# Altium project CorgPass.PrjPcb
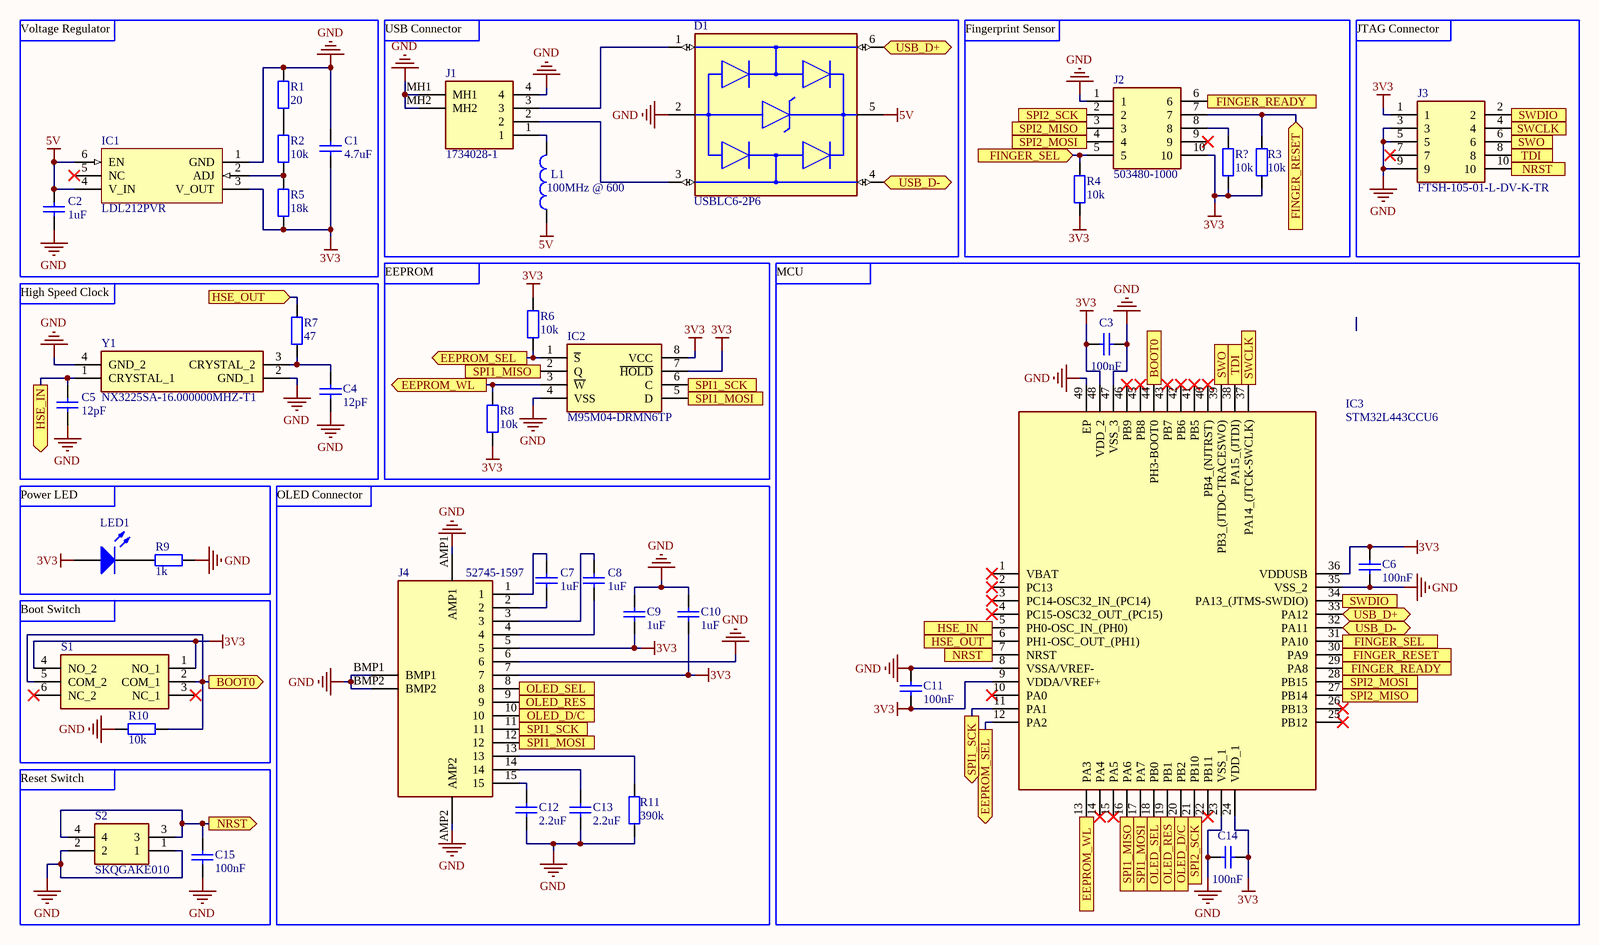
[diagram p0: CorgPassRev1.SchDoc]
1 sheet, 40 parts. Net scope: flat (ports and power ports of the same name join across sheets).
Board files: CorgPassRev1.PcbDoc, CorgPassRev2.PcbDoc

## Sheet CorgPassRev1.SchDoc: CorgPass
size A3; Author: martinkors; DrawnBy: martinkors; DocumentNumber: 1/1; Revision: 01; SheetNumber: 1; SheetTotal: 1

### Parts
C1  4.7uF  [CL10A475KQ8NNNC]
C2  value 1uF  [CL05A105KQ5NNNC]  (hidden comment: Cap)
C3  value 100nF  [CL05B104KQ5NNNC]  (hidden comment: Cap)
C4  value 12pF  [CL10C120JB81PNC]  (hidden comment: Cap)
C5  value 12pF  [CL10C120JB81PNC]  (hidden comment: Cap)
C6  value 100nF  [CL05B104KQ5NNNC]  (hidden comment: Cap)
C7  value 1uF  [CL05A105KQ5NNNC]  (hidden comment: Cap)
C8  value 1uF  [CL05A105KQ5NNNC]  (hidden comment: Cap)
C9  value 1uF  [CL05A105KQ5NNNC]  (hidden comment: Cap)
C10  value 1uF  [CL05A105KQ5NNNC]  (hidden comment: Cap)
C11  value 100nF  [CL05B104KQ5NNNC]  (hidden comment: Cap)
C12  value 2.2uF  [CL10A225KA8NNNC]  (hidden comment: Cap)
C13  value 2.2uF  [CL10A225KA8NNNC]  (hidden comment: Cap)
C14  value 100nF  [CL05B104KQ5NNNC]  (hidden comment: Cap)
C15  value 100nF  [CL05B104KQ5NNNC]  (hidden comment: Cap)
D1  USBLC6-2P6  [FP-SOT-666-MFG]
IC1  LDL212PVR  [LDL212PVR]
IC2  M95M04-DRMN6TP  [SOIC127P600X175-8N]
IC3  STM32L443CCU6  [QFN50P700X700X60-49N-D]
J1  1734028-1  [117340281]
J2  503480-1000  [5034801000]
J3  FTSH-105-01-L-DV-K-TR  [FTSH10501LDVKTR]
J4  52745-1597  [527451597]
L1  100MHz @ 600  [742792040]
LED1  150080RS75000  [0805_A]  (value not drawn)
R1  value 20  [ERJ-UP3F20R0V]  (hidden comment: Res2)
R2  value 10k  [ERJ-UP3F1002V]  (hidden comment: Res2)
R3  value 10k  [ERJ-UP3F1002V]  (hidden comment: Res2)
R4  value 10k  [ERJ-UP3F1002V]  (hidden comment: Res2)
R5  value 18k  [ERJ-UP3F1802V]  (hidden comment: Res2)
R6  value 10k  [ERJ-UP3F1002V]  (hidden comment: Res2)
R7  value 47  [ERJ-UP3J470V]  (hidden comment: Res2)
R8  value 10k  [ERJ-UP3F1002V]  (hidden comment: Res2)
R9  value 1k  [ERJ-UP3F1001V]  (hidden comment: Res2)
R10  value 10k  [ERJ-UP3F1002V]  (hidden comment: Res2)
R11  value 390k  [ERJ-UP3F3903V]  (hidden comment: Res2)
R?  value 10k  [ERJ-UP3F1002V]  (hidden comment: Res2)
S1  452403012014  [452403012014]  (value not drawn)
S2  SKQGAKE010  [SKQGAKE010]
Y1  NX3225SA-16.000000MHZ-T1  [NX3225SA16000000MHZT1]

### Ports
BOOT0 (in), BOOT0 (out), EEPROM_SEL (out), EEPROM_WL (out), FINGER_READY (in), FINGER_READY (out), FINGER_RESET (in), FINGER_RESET (out), FINGER_SEL (in), FINGER_SEL (out), HSE_IN (in), HSE_IN (out), HSE_OUT (in), HSE_OUT (out), NRST (in), NRST (out), OLED_D/C (in), OLED_D/C (out), OLED_RES (in), OLED_RES (out), OLED_SEL (in), OLED_SEL (out), SPI1_MISO (in), SPI1_MISO (out), SPI1_MOSI (in), SPI1_MOSI (out), SPI1_SCK (in), SPI1_SCK (out), SPI2_MISO (in), SPI2_MISO (out), SPI2_MOSI (in), SPI2_MOSI (out), SPI2_SCK (in), SPI2_SCK (out), SWCLK (in), SWDIO (in), SWO (in), TDI (in), USB_D+ (bidir), USB_D- (bidir)

### Nets
3V3: C1.1 C3.2 C6.1 C9.2 C10.2 C11.2 C14.1 IC1.3(V_OUT) IC2.7(~{HOLD}) IC2.8(VCC) IC3.9(VDDA/VREF+) IC3.24(VDD_1) IC3.36(VDDUSB) IC3.48(VDD_2) J2.10 J3.1 J4.5 J4.7 LED1.2(A) R3.1 R4.1 R5.1 R6.2 R8.1 R?.1 S1.1(NO_1) S1.4(NO_2)
5V: C2.2 D1.5(VBUS) IC1.4(V_IN) IC1.6(EN) L1.1
GND: C1.2 C2.1 C3.1 C4.1 C5.1 C6.2 C9.1 C10.1 C11.1 C12.1 C13.2 C14.2 C15.2 D1.2(GND) IC1.1(GND) IC2.4(VSS) IC3.8(VSSA/VREF-) IC3.23(VSS_1) IC3.35(VSS_2) IC3.47(VSS_3) IC3.49(EP) J1.4 J1.MH1 J1.MH2 J2.1 J3.3 J3.5 J3.9 J4.6 J4.AMP1 J4.AMP2 J4.BMP1 J4.BMP2 R1.2 R9.1 R10.2 R11.1 S2.1 S2.2 Y1.2(GND_1) Y1.4(GND_2)
NetC4_2: C4.2 R7.1 Y1.3(CRYSTAL_2)
NetC5_2: C5.2 IC3.5(PH0-OSC_IN_(PH0)) Y1.1(CRYSTAL_1) ; port HSE_IN
NetC7_1: C7.1 J4.2
NetC7_2: C7.2 J4.1
NetC8_1: C8.1 J4.3
NetC8_2: C8.2 J4.4
NetC12_2: C12.2 J4.15
NetC13_1: C13.1 J4.14
NetC15_1: C15.1 IC3.7(NRST) J3.10 S2.3 S2.4 ; port NRST
NetD1_1: D1.1(I/O1) J1.3
NetD1_3: D1.3(I/O2) J1.2
NetD1_4: D1.4(I/O2) IC3.32(PA11) ; port USB_D-
NetD1_6: D1.6(I/O1) IC3.33(PA12) ; port USB_D+
NetIC1_2: IC1.2(ADJ) R2.1 R5.2
NetIC2_1: IC2.1(~{S}) IC3.12(PA2) R6.1 ; port EEPROM_SEL
NetIC2_2: IC2.2(Q) IC3.16(PA6) ; port SPI1_MISO
NetIC2_3: IC2.3(~{W}) IC3.13(PA3) R8.2 ; port EEPROM_WL
NetIC2_5: IC2.5(D) IC3.17(PA7) J4.12 ; port SPI1_MOSI
NetIC2_6: IC2.6(C) IC3.11(PA1) J4.11 ; port SPI1_SCK
NetIC3_6: IC3.6(PH1-OSC_OUT_(PH1)) R7.2 ; port HSE_OUT
NetIC3_18: IC3.18(PB0) J4.8 ; port OLED_SEL
NetIC3_19: IC3.19(PB1) J4.9 ; port OLED_RES
NetIC3_20: IC3.20(PB2) J4.10 ; port OLED_D/C
NetIC3_21: IC3.21(PB10) J2.2 ; port SPI2_SCK
NetIC3_27: IC3.27(PB14) J2.3 ; port SPI2_MISO
NetIC3_28: IC3.28(PB15) J2.4 ; port SPI2_MOSI
NetIC3_29: IC3.29(PA8) J2.6 ; port FINGER_READY
NetIC3_30: IC3.30(PA9) J2.7 R3.2 ; port FINGER_RESET
NetIC3_31: IC3.31(PA10) J2.5 R4.2 ; port FINGER_SEL
NetIC3_34: IC3.34(PA13_(JTMS-SWDIO)) J3.2 ; port SWDIO
NetIC3_37: IC3.37(PA14_(JTCK-SWCLK)) J3.4 ; port SWCLK
NetIC3_38: IC3.38(PA15_(JTDI)) J3.8 ; port TDI
NetIC3_39: IC3.39(PB3_(JTDO-TRACESWO)) J3.6 ; port SWO
NetIC3_44: IC3.44(PH3-BOOT0) R10.1 S1.2(COM_1) S1.5(COM_2) ; port BOOT0
NetJ1_1: J1.1 L1.2
NetJ2_8: J2.8 R?.2
NetJ4_13: J4.13 R11.2
NetLED1_1: LED1.1(K) R9.2
NetR1_1: R1.1 R2.2

Not connected (* = marked no-connect by the designer): IC1 5(NC)*; IC3 1(VBAT)* 2(PC13)* 3(PC14-OSC32_IN_(PC14))* 4(PC15-OSC32_OUT_(PC15))* 10(PA0)* 14(PA4)* 15(PA5)* 22(PB11)* 25(PB12)* 26(PB13)* 40(PB4_(NJTRST))* 41(PB5)* 42(PB6)* 43(PB7)* 45(PB8)* 46(PB9)*; J2 9*; J3 7*; S1 3(NC_1)* 6(NC_2)*

### Notes on the sheet
- Voltage Regulator
- USB Connector
- Fingerprint Sensor
- JTAG Connector
- High Speed Clock
- EEPROM
- MCU
- Power LED
- OLED Connector
- Boot Switch
- Reset Switch

### Library data of the parts
C1 = Cap: Cap Ceramic 4.7uF 6.3V X5R 10% SMD 0603 85°C Paper T/R; Manufacturer: Samsung; Tolerance: 20%; Published: 8-Jun-2000; LatestRevisionDate: 17-Jul-2002; LatestRevisionNote: Re-released for DXP Platform.; PackageReference: RAD-0.3; Publisher: Altium Limited; PackageDescription: Radial Cap, Thru-Hole; 2 Leads; 0.3 in Pin Spacing; Value: 4.7uF; Supplier 1: Mouser; Supplier Part Number 1: 187-CL10A475KQ8NNNC; Manufacturer Part Number: CL10A475KQ8NNNC; RoHS: Yes; Category: Ceramic Capacitors; Stock 1: 199260; Pricing 1: 1=0.13000, 10=0.04700, 50=0.04700, 100=0.02100, 500=0.01500, 1000=0.01200, 4000=0.01000, 8000=0.00800, 10000=0.00800 (USD); Mount: Surface Mount; Case/Package: 0603; Case Code (Metric): 1608; Case Code (Imperial): 0603; Material: Ceramic; Contact Plating: Tin; Min Operating Temperature: -55°C; Max Operating Temperature: 85°C; Capacitance: 4.7uF; Dielectric: X5R; Packaging: Tape and Reel; Package Quantity: 1; Voltage Rating: 6.3V; Voltage: 6.3V; Series: CL; Construction: Flat; Length: 1.6mm; Width: 0.031inch; Height: 0.8mm; Thickness: 0.035inch; Depth: 0.8mm; Radiation Hardening: No; RoHS Compliant: Yes; ComponentLink1URL: https://datasheet.ciiva.com/15195/getdatasheetpartid-358620-15195714.pdf?src-supplier=Verical; ComponentLink1Description: https://datasheet.ciiva.com/15195/getdatasheetpartid-358620-15195714.pdf?src-supplier=Verical; ComponentLink2URL: https://datasheet.ciiva.com/29198/457675-da-01-en-vs-kondensator-0603-29198672.pdf?src-supplier=Conrad; ComponentLink2Description: https://datasheet.ciiva.com/29198/457675-da-01-en-vs-kondensator-0603-29198672.pdf?src-supplier=Conrad; ComponentLink3URL: https://datasheet.ciiva.com/16437/cl05b104kq5nnnc-16437321.pdf?src-supplier=Future+Electronics; ComponentLink3Description: https://datasheet.ciiva.com/16437/cl05b104kq5nnnc-16437321.pdf?src-supplier=Future+Electronics
C2 C7-C10 = Cap: Ceramic capacitor SMD-0402 1000nF /6.3V X5R# K +-10%, Samsung, RoHS; Tolerance: 10%; Dielectric: X5R; Voltage Rating: 6.3V; Published: 8-Jun-2000; LatestRevisionDate: 17-Jul-2002; LatestRevisionNote: Re-released for DXP Platform.; PackageReference: RAD-0.3; Publisher: Altium Limited; PackageDescription: Radial Cap, Thru-Hole; 2 Leads; 0.3 in Pin Spacing; Supplier 1: Mouser; Supplier Part Number 1: 187-CL05A105KQ5NNNC; Manufacturer: Samsung; Manufacturer Part Number: CL05A105KQ5NNNC; RoHS: Yes; Category: Ceramic Capacitors; Stock 1: 1554203; Pricing 1: 1=0.10000, 10=0.01100, 50=0.01100, 100=0.00900, 500=0.00700, 1000=0.00500, 5000=0.00400, 10000=0.00300 (USD); Mount: Surface Mount; Case/Package: 0402; Case Code (Metric): 1005; Case Code (Imperial): 0402; Material: Ceramic; Min Operating Temperature: -55°C; Max Operating Temperature: 85°C; Capacitance: 1uF; Packaging: Tape and Reel; Voltage: 6.3V; Voltage Rating (DC): 6.3V; Series: CL; Construction: Flat; Length: 1mm; Width: 0.02inch; Height: 0.5mm; Thickness: 0.022inch; Depth: 0.5mm; Radiation Hardening: No; Lead Free: Lead Free; RoHS Compliant: Yes; ComponentLink1URL: https://datasheet.ciiva.com/25709/cl05a105kq5nnnc-25709776.pdf?src-supplier=Digi-Key; ComponentLink1Description: https://datasheet.ciiva.com/25709/cl05a105kq5nnnc-25709776.pdf?src-supplier=Digi-Key; ComponentLink2URL: https://datasheet.ciiva.com/15195/getdatasheetpartid-358391-15195631.pdf?src-supplier=Verical; ComponentLink2Description: https://datasheet.ciiva.com/15195/getdatasheetpartid-358391-15195631.pdf?src-supplier=Verical; ComponentLink3URL: https://datasheet.ciiva.com/29198/459172-da-01-en-vs-kondensator-0402-29198343.pdf?src-supplier=Conrad; ComponentLink3Description: https://datasheet.ciiva.com/29198/459172-da-01-en-vs-kondensator-0402-29198343.pdf?src-supplier=Conrad; ComponentLink4URL: https://datasheet.ciiva.com/16339/cl05b104kq5nnnc-16339614.pdf?src-supplier=Future+Electronics; ComponentLink4Description: https://datasheet.ciiva.com/16339/cl05b104kq5nnnc-16339614.pdf?src-supplier=Future+Electronics
C3 C6 C11 C14 C15 = Cap: Cap Ceramic 0.1uF 6.3V X7R 10% SMD 0402 125°C Paper T/R; Manufacturer: Samsung; Published: 8-Jun-2000; LatestRevisionDate: 17-Jul-2002; LatestRevisionNote: Re-released for DXP Platform.; PackageReference: RAD-0.3; Publisher: Altium Limited; PackageDescription: Radial Cap, Thru-Hole; 2 Leads; 0.3 in Pin Spacing; Supplier 1: Mouser; Supplier Part Number 1: 187-CL05B104KQ5NNNC; Manufacturer Part Number: CL05B104KQ5NNNC; RoHS: Yes; Category: Ceramic Capacitors; Stock 1: 56542; Pricing 1: 1=0.10000, 10=0.01400, 50=0.01400, 100=0.01200, 1000=0.00700, 10000=0.00400 (USD); Mount: Surface Mount; Case/Package: 0402; Case Code (Metric): 1005; Case Code (Imperial): 0402; Min Operating Temperature: -55°C; Max Operating Temperature: 125°C; Tolerance: 10%; Capacitance: 100nF; Dielectric: X7R; Packaging: Tape and Reel; Voltage Rating: 6.3V; Voltage Rating (DC): 6.3V; Length: 1mm; Width: 0.02inch; Height: 0.5mm; Thickness: 0.022inch; Depth: 0.5mm; Radiation Hardening: No; Lead Free: Lead Free; ComponentLink1URL: https://datasheet.ciiva.com/25709/cl05b104kq5nnnc-25709268.pdf?src-supplier=Digi-Key; ComponentLink1Description: https://datasheet.ciiva.com/25709/cl05b104kq5nnnc-25709268.pdf?src-supplier=Digi-Key; ComponentLink2URL: https://datasheet.ciiva.com/26838/getdatasheetpartid-494330-26838215.pdf?src-supplier=Verical; ComponentLink2Description: https://datasheet.ciiva.com/26838/getdatasheetpartid-494330-26838215.pdf?src-supplier=Verical; ComponentLink3URL: https://datasheet.ciiva.com/16498/cl05b104kq5nnnc-16498492.pdf?src-supplier=Future+Electronics; ComponentLink3Description: https://datasheet.ciiva.com/16498/cl05b104kq5nnnc-16498492.pdf?src-supplier=Future+Electronics
C4 C5 = Cap: Cap Ceramic 12pF 50V C0G 5% SMD 0603 125C Automotive Cardboard T/R; Manufacturer: Samsung; Temperature Coefficient: 300ppm/°C; Published: 8-Jun-2000; LatestRevisionDate: 17-Jul-2002; LatestRevisionNote: Re-released for DXP Platform.; PackageReference: RAD-0.3; Publisher: Altium Limited; PackageDescription: Radial Cap, Thru-Hole; 2 Leads; 0.3 in Pin Spacing; Supplier 1: Mouser; Supplier Part Number 1: 187-CL10C120JB81PNC; Manufacturer Part Number: CL10C120JB81PNC; RoHS: Yes; Category: Ceramic Capacitors; Stock 1: 33780; Pricing 1: 1=0.11000, 10=0.05000, 50=0.05000, 100=0.02300, 1000=0.01300, 10000=0.00800 (USD); Mount: Surface Mount; Case/Package: 0603; Case Code (Metric): 1608; Case Code (Imperial): 0603; Min Operating Temperature: -55°C; Max Operating Temperature: 125°C; Packaging: Tape and Reel; Tolerance: 5%; Package Quantity: 4000; Capacitance: 12pF; Voltage Rating: 50V; Voltage: 50V; Dielectric: C0G; Length: 1.6mm; Width: 0.031inch; Height: 0.8mm; Thickness: 0.035inch; Depth: 0.8mm; Ratings: AEC-Q200; Radiation Hardening: No; Lead Free: Lead Free; ComponentLink1URL: https://datasheet.ciiva.com/15195/getdatasheetpartid-494032-15195793.pdf?src-supplier=Verical; ComponentLink1Description: https://datasheet.ciiva.com/15195/getdatasheetpartid-494032-15195793.pdf?src-supplier=Verical; ComponentLink2URL: https://datasheet.ciiva.com/16437/cl10c120jb81pnc-16437304.pdf?src-supplier=Future+Electronics; ComponentLink2Description: https://datasheet.ciiva.com/16437/cl10c120jb81pnc-16437304.pdf?src-supplier=Future+Electronics
C12 C13 = Cap: Ceramic capacitor SMD-0603 2200nF/25V X5R# K +-10%, SAMSUNG, RoHS; Tolerance: 10%; Dielectric: X5R; Voltage Rating: 25V; Published: 8-Jun-2000; LatestRevisionDate: 17-Jul-2002; LatestRevisionNote: Re-released for DXP Platform.; PackageReference: RAD-0.3; Publisher: Altium Limited; PackageDescription: Radial Cap, Thru-Hole; 2 Leads; 0.3 in Pin Spacing; Supplier 1: Mouser; Supplier Part Number 1: 187-CL10A225KA8NNNC; Manufacturer: Samsung; Manufacturer Part Number: CL10A225KA8NNNC; RoHS: Yes; Category: Ceramic Capacitors; Stock 1: 114346; Pricing 1: 1=0.22000, 10=0.09000, 50=0.09000, 100=0.07700, 500=0.05300, 1000=0.04700, 4000=0.04000, 8000=0.03800, 10000=0.03800 (USD); Mount: Surface Mount; Case/Package: 0603; Case Code (Metric): 1608; Case Code (Imperial): 0603; Min Operating Temperature: -55°C; Max Operating Temperature: 85°C; Capacitance: 2.2uF; Packaging: Tape and Reel; Package Quantity: 1; Voltage Rating (DC): 25V; Series: CL; Construction: Flat; Length: 1.6mm; Width: 0.031inch; Height: 0.8mm; Thickness: 0.035inch; Depth: 0.8mm; Radiation Hardening: No; Lead Free: Lead Free; RoHS Compliant: Yes; ComponentLink1URL: https://datasheet.ciiva.com/25797/cl10a225ka8nnnc-25797781.pdf?src-supplier=Digi-Key; ComponentLink1Description: https://datasheet.ciiva.com/25797/cl10a225ka8nnnc-25797781.pdf?src-supplier=Digi-Key
D1 = CMP-12225-000058-1: TVS DIODE 5.25V 17V SOT666; Manufacturer: STMicroelectronics; Min Breakdown Voltage: 6V; Power Line Protection: Yes; Element Configuration: Dual; Test Current: 1mA; Working Voltage: 5V; Number of Channels: 2; Max Reverse Leakage Current: 150nA; Direction: Unidirectional; Peak Pulse Current: 5A; Number of Elements: 1; Capacitance: 3.5pF; Max Breakdown Voltage: 6V; Height: 0.6mm; Depth: 1.3mm; Contact Plating: Tin; Reverse Breakdown Voltage: 6V; REACH SVHC: No SVHC; Operating Supply Voltage: 5V; Width: 1.3mm; Max Operating Temperature: 125°C; Reverse Standoff Voltage: 5V; ESD Protection: Yes; Package Quantity: 1; Termination: SMD/SMT; Length: 1.7mm; Leakage Current: 150nA; Number of Bidirectional Channels: 2; Case/Package: SOT-666; Min Operating Temperature: -40°C; Number of Pins: 6; Clamping Voltage: 17V; Breakdown Voltage: 6V; Lead Free: Lead Free; Radiation Hardening: No; Packaging: Tape and Reel; Mount: Surface Mount; Polarity: Unidirectional; Supplier 1: Mouser; Supplier Part Number 1: 511-USBLC6-2P6; Manufacturer Part Number: USBLC6-2P6; RoHS: Yes; Category: TVS Diodes; Pricing 1: 1=0.65000, 10=0.55700, 50=0.55700, 100=0.41600, 500=0.32700, 1000=0.25300, 3000=0.23000, 10000=0.23000 (USD); Series: USB; Clamping Voltage-Max: 17V; RoHS Compliant: Yes; ComponentLink1URL: https://datasheet.ciiva.com/14186/usblc6-2-st-eng-tds-14186568.pdf?src-supplier=Distrelec; ComponentLink1Description: https://datasheet.ciiva.com/14186/usblc6-2-st-eng-tds-14186568.pdf?src-supplier=Distrelec; ComponentLink2URL: https://datasheet.ciiva.com/22685/1690354-22685832.pdf?src-supplier=Element14; ComponentLink2Description: https://datasheet.ciiva.com/22685/1690354-22685832.pdf?src-supplier=Element14; ComponentLink3URL: https://datasheet.ciiva.com/22692/1690354-22692453.pdf?src-supplier=Element14; ComponentLink3Description: https://datasheet.ciiva.com/22692/1690354-22692453.pdf?src-supplier=Element14; ComponentLink4URL: https://datasheet.ciiva.com/4508/cd00050750-4508892.pdf?src-supplier=Mouser; ComponentLink4Description: https://datasheet.ciiva.com/4508/cd00050750-4508892.pdf?src-supplier=Mouser; ComponentLink5URL: https://datasheet.ciiva.com/16378/cd00050750-16378714.pdf?src-supplier=Future+Electronics; ComponentLink5Description: https://datasheet.ciiva.com/16378/cd00050750-16378714.pdf?src-supplier=Future+Electronics; ComponentLink6URL: https://datasheet.ciiva.com/41444/001184108-da-01-en-ic-esd-protection-usblc6-2p6-sot-666-stm-41444134.pdf?src-supplier=Conrad; ComponentLink6Description: https://datasheet.ciiva.com/41444/001184108-da-01-en-ic-esd-protection-usblc6-2p6-sot-666-stm-41444134.pdf?src-supplier=Conrad
IC1 = LDL212PVR: LDL212 Series 18 V 1.2 A Adj. High PSRR Low Drop Linear Regulator IC - DFN-6; Manufacturer: STMicroelectronics; Output Voltage: 17.65V; Output Current: 1.2A; Dropout Voltage: 350mV; Number of Regulators: 1; Supplier 1: Mouser; Supplier Part Number 1: 511-LDL212PVR; Manufacturer Part Number: LDL212PVR; RoHS: Yes; Category: Voltage Regulators - Linear; Pricing 1: 1=0.63000, 10=0.50200, 50=0.50200, 100=0.37300, 500=0.31500, 1000=0.24400, 3000=0.22100, 6000=0.21600, 10000=0.21600 (USD); Min Operating Temperature: -40°C; Max Operating Temperature: 125°C; RoHS Compliant: Yes; ComponentLink1URL: http://www.mouser.com/ds/2/389/ldl212-974162.pdf?src-supplier=Mouser; ComponentLink1Description: http://www.mouser.com/ds/2/389/ldl212-974162.pdf?src-supplier=Mouser; ComponentLink2URL: http://www.st.com/content/ccc/resource/sales_and_marketing/promotional_material/brochure/group0/cb/7a/af/56/f7/bd/47/e9/Brochure%20Power%20management%20guide/files/Brochure_Power_Management.pdf/jcr:content/translations/en.Brochure_Power_Management.pdf?src-supplier=Digi-Key; ComponentLink2Description: http://www.st.com/content/ccc/resource/sales_and_marketing/promotional_material/brochure/group0/cb/7a/af/56/f7/bd/47/e9/Brochure%20Power%20management%20guide/files/Brochure_Power_Management.pdf/jcr:content/translations/en.Brochure_Power_Management.pdf?src-supplier=Digi-Key
IC2 = M95M04-DRMN6TP: EEPROM Spi 4MBIT 512K X 8 1.8V to 5.5V 8-PIN SOIC T/r; Manufacturer_Name: STMicroelectronics; Datasheet Link: https://componentsearchengine.com/Datasheets/1/M95M04-DRMN6TP.pdf; Height: 1.75mm; Manufacturer_Part_Number: M95M04-DRMN6TP; Supplier 1: Mouser; Supplier Part Number 1: 511-M95M04-DRMN6TP; Manufacturer: STMicroelectronics; Manufacturer Part Number: M95M04-DRMN6TP; RoHS: Yes; Category: Memory; Stock 1: 1275; Pricing 1: 1=3.16000, 10=2.80000, 50=2.80000, 100=2.50000, 1000=2.29000, 10000=2.28000 (USD)
IC3 = STM32L443CCU6: Ultra-low-power with FPU ARM Cortex-M4 MCU 80 MHz with 256 Kbytes Flash, LCD, USB, AES-256; Manufacturer_Name: STMicroelectronics; Interface: I2C,SPI,USB,IrDA,MMC,SD,UART,USART; Peripherals: Brown-out Detect/Reset,PWM,WDT,DMA,LCD; Frequency: 80MHz; Number of I/Os: 38; Memory Size: 256KB; Oscillator Type: Internal; Datasheet Link: https://componentsearchengine.com//STM32L443CCU6.pdf; Height: 0.6mm; Mouser2 Part Number: 511-STM32L443CCU6; Mouser2 Price/Stock: https://www.mouser.com/Search/Refine.aspx?Keyword=511-STM32L443CCU6; Manufacturer_Part_Number: STM32L443CCU6; Supplier 1: Mouser; Supplier Part Number 1: 511-STM32L443CCU6; Manufacturer: STMicroelectronics; Manufacturer Part Number: STM32L443CCU6; RoHS: Yes; Category: Microcontrollers; Stock 1: 40; Pricing 1: 1=7.24000, 10=6.55000, 25=6.25000, 50=6.25000, 100=5.43000, 250=5.18000, 500=4.73000, 1000=4.07000, 2500=4.06000, 10000=4.07000 (USD); Case/Package: UFQFPN; Number of Pins: 48; Min Operating Temperature: -40°C; Max Operating Temperature: 85°C; Memory Type: FLASH; Packaging: Tray; Core Architecture: ARM; ComponentLink1URL: http://www.st.com/content/ccc/resource/technical/document/datasheet/01/76/9c/b5/c7/d9/40/6c/DM00254865.pdf/files/DM00254865.pdf/jcr:content/translations/en.DM00254865.pdf?src-supplier=Digi-Key; ComponentLink1Description: http://www.st.com/content/ccc/resource/technical/document/datasheet/01/76/9c/b5/c7/d9/40/6c/DM00254865.pdf/files/DM00254865.pdf/jcr:content/translations/en.DM00254865.pdf?src-supplier=Digi-Key
J1 = 1-1734028-1: Conn USB 2.0 Type A PL 4 POS Solder RA Edge Mount 4 Terminal 1 Port Tray; Manufacturer: TE Connectivity; Plating: Copper; Number of Terminals/Pins: 4; Gender: Female; Connector Type: Plug; Number of Ports: 1; Circuit Application: Signal; Connector System: Cable-to-Board; Contact Current Rating: 1.5A; Max Voltage Rating (AC): 30V; Plating Thickness: 0.76um; Pitch: 2.5mm; PCB Thickness: 1.6mm; Supplier 1: Mouser; Supplier Part Number 1: 571-1734028-1; Manufacturer Part Number: 1734028-1; RoHS: Yes; Category: Audio / Video Connectors; Stock 1: 6449; Pricing 1: 1=1.51000, 10=1.19000, 50=1.19000, 100=0.99100, 500=0.85000, 1000=0.79500, 2500=0.74400, 5000=0.72100, 9600=0.70000, 10000=0.70000, 25600=0.64500 (USD); Mount: Surface Mount,Horizontal,Edge; Contact Material: Brass; Contact Plating: Gold; Housing Material: Thermoplastic; Housing Color: Natural; Color: Natural; Min Operating Temperature: -67°C; Max Operating Temperature: 185°C; Number of Contacts: 4; Termination: SMD/SMT; Packaging: Tape and Reel; Package Quantity: 3200; Orientation: Right Angle; Number of Positions: 4; Length: 12mm; Depth: 19.65mm; Radiation Hardening: No; Flammability Rating: UL94 V-0; ELV: Compliant; Lead Free: Lead Free; ComponentLink1URL: https://datasheet.ciiva.com/3094/eng-ds-1-1773453-6-0908-3094652.pdf?src-supplier=Avnet; ComponentLink1Description: https://datasheet.ciiva.com/3094/eng-ds-1-1773453-6-0908-3094652.pdf?src-supplier=Avnet; ComponentLink2URL: https://datasheet.ciiva.com/851/eng-cd-1734028-c-851585.pdf?src-supplier=Digi-Key; ComponentLink2Description: https://datasheet.ciiva.com/851/eng-cd-1734028-c-851585.pdf?src-supplier=Digi-Key; ComponentLink3URL: https://datasheet.ciiva.com/16313/tyco201734028-1-16313266.pdf?src-supplier=Future+Electronics; ComponentLink3Description: https://datasheet.ciiva.com/16313/tyco201734028-1-16313266.pdf?src-supplier=Future+Electronics; ComponentLink4URL: https://datasheet.ciiva.com/16668/eng-ds-1-1773453-6-0908-16668521.pdf?src-supplier=Avnet+Europe; ComponentLink4Description: https://datasheet.ciiva.com/16668/eng-ds-1-1773453-6-0908-16668521.pdf?src-supplier=Avnet+Europe; Name: 1734028-1
J2 = 503480-1000: FPC/FFC 间距0.5mm 10pin 前插后压 H=1.0mm; Manufacturer_Name: Molex; Actuator Material: Nylon,Glass,Polyamide; Current Rating: 500mA; Voltage Rating: 50V; Number of Positions: 10; Gender: Receptacle; Wire/Cable Type: Straight; Stackable: No; Pitch: 0.5mm; Datasheet Link: https://componentsearchengine.com//503480-1000.pdf; Mouser2 Part Number: 538-503480-1000; Mouser2 Price/Stock: https://www.mouser.com/Search/Refine.aspx?Keyword=538-503480-1000; Manufacturer_Part_Number: 503480-1000; Supplier 1: Mouser; Supplier Part Number 1: 538-503480-1000; Manufacturer: Molex; Manufacturer Part Number: 503480-1000; RoHS: Yes; Category: FFC / FPC; Stock 1: 13096; Pricing 1: 1=1.41000, 10=1.20000, 50=1.20000, 100=0.99000, 500=0.91200, 1000=0.78200, 3000=0.72900, 6000=0.69200, 9000=0.67600, 10000=0.67600, 24000=0.65100 (USD); Contact Material: Bronze; Contact Plating: Gold; Housing Material: Polymer; Housing Color: White; Material: Bronze; Min Operating Temperature: -40°C; Max Operating Temperature: 85°C; Package Quantity: 1; Number of Rows: 1; Packaging: Tape and Reel; Termination: Solder; Number of Contacts: 10; Orientation: Right Angle; Voltage Rating (AC): 50V; Max Voltage Rating (AC): 50V; Max Voltage Rating (DC): 50V; Number of Circuits: 10; Mating Cycles: 10; Length: 6.7mm; Depth: 3.6mm; Radiation Hardening: No; REACH SVHC: Unknown; Halogen Free: Low Halogen; ELV: Compliant; Flammability Rating: UL94 V-0; ComponentLink1URL: https://datasheet.ciiva.com/5137/5034801000-ffc-fpc-connectors-179433-5137762.pdf?src-supplier=Mouser; ComponentLink1Description: https://datasheet.ciiva.com/5137/5034801000-ffc-fpc-connectors-179433-5137762.pdf?src-supplier=Mouser; ComponentLink2URL: https://datasheet.ciiva.com/26916/getdatasheetpartid-735332-26916946.pdf?src-supplier=Verical; ComponentLink2Description: https://datasheet.ciiva.com/26916/getdatasheetpartid-735332-26916946.pdf?src-supplier=Verical; ComponentLink3URL: https://datasheet.ciiva.com/16658/5034801000-ffc-fpc-connectors-16658884.pdf?src-supplier=Avnet+Europe; ComponentLink3Description: https://datasheet.ciiva.com/16658/5034801000-ffc-fpc-connectors-16658884.pdf?src-supplier=Avnet+Europe; ComponentLink4URL: https://datasheet.ciiva.com/671/5034801000-sd-671179.pdf?src-supplier=Digi-Key; ComponentLink4Description: https://datasheet.ciiva.com/671/5034801000-sd-671179.pdf?src-supplier=Digi-Key
J3 = FTSH-105-01-L-DV-K-TR: Conn Unshrouded Header HDR 10 POS 1.27mm Solder ST Top Entry SMD T/R; Manufacturer: Samtec; Number of Contacts: 10; Max Current Rating: 1.75A; Gender: Male; Connector Type: Male Pin; Row Spacing: 0.05inch; Supplier 1: Mouser; Supplier Part Number 1: 200-FTSH10501LDVKTR; Manufacturer Part Number: FTSH-105-01-L-DV-K-TR; RoHS: Yes; Category: Headers and Wire Housings; Stock 1: 8719; Pricing 1: 1=4.22000, 10=4.06000, 50=4.06000, 100=3.38000, 550=2.88000, 1000=2.88000, 1100=2.45000, 2200=2.24000, 4950=2.19000, 9900=2.14000, 10000=2.24000 (USD); Mount: Surface Mount; Contact Plating: Gold; Contact Material: Bronze; Housing Color: Black; Housing Material: Polymer; Color: Black; Min Operating Temperature: -55°C; Max Operating Temperature: 125°C; Number of Rows: 2; Termination: Solder; Packaging: Tape and Reel; Orientation: Straight; Package Quantity: 550; Number of Positions: 10; Current Rating: 1.75A; Series: FTSH; Contact Type: Male Pin; Length: 6.35mm; Pitch: 1.27mm; Depth: 3.43mm; Contact Mating Length: 0.12inch; Radiation Hardening: No; Lead Free: Lead Free; RoHS Compliant: Yes; REACH SVHC: No SVHC; ComponentLink1URL: https://datasheet.ciiva.com/23735/81359-23735917.pdf?src-supplier=Newark; ComponentLink1Description: https://datasheet.ciiva.com/23735/81359-23735917.pdf?src-supplier=Newark; ComponentLink2URL: https://datasheet.ciiva.com/10245/ftsh-mt-10245289.pdf?src-supplier=Avnet; ComponentLink2Description: https://datasheet.ciiva.com/10245/ftsh-mt-10245289.pdf?src-supplier=Avnet; ComponentLink3URL: https://datasheet.ciiva.com/739/ftsh-1xx-xx-xxx-dv-xxx-mkt-739005.pdf?src-supplier=Digi-Key; ComponentLink3Description: https://datasheet.ciiva.com/739/ftsh-1xx-xx-xxx-dv-xxx-mkt-739005.pdf?src-supplier=Digi-Key
J4 = 52745-1597: Easy-On FFC/FPC Connector, 0.50mm Pitch, Slider Series, Right-Angle, Top Contact, 2.00mm Height, 15 Circuits, Gold...; Manufacturer_Name: Molex; Voltage Rating: 50V; Current Rating: 500mA; Number of Positions: 15; Gender: Receptacle; Stackable: No; Pitch: 0.5mm; Datasheet Link: https://www.molex.com/pdm_docs/sd/527451597_sd.pdf; Height: 2.2mm; Manufacturer_Part_Number: 52745-1597; Supplier 1: Mouser; Supplier Part Number 1: 538-52745-1597; Manufacturer: Molex; Manufacturer Part Number: 52745-1597; RoHS: Yes; Category: FFC / FPC; Stock 1: 12092; Pricing 1: 1=2.22000, 10=1.90000, 50=1.90000, 100=1.57000, 500=1.45000, 1000=1.23000, 2000=1.15000, 5000=1.09000, 10000=1.07000, 25000=1.03000 (USD); Contact Material: Bronze; Contact Plating: Gold; Material: Bronze; Number of Rows: 1; Termination: SMD/SMT; Orientation: Right Angle; Package Quantity: 1000; Packaging: Tape and Reel; Number of Contacts: 15; Series: 52745; Number of Circuits: 15; Radiation Hardening: No; REACH SVHC: Unknown; ELV: Compliant; Flammability Rating: UL94 V-0; RoHS Compliant: Yes; ComponentLink1URL: https://datasheet.ciiva.com/5137/0527451597-ffc-fpc-connectors-170644-5137506.pdf?src-supplier=Mouser; ComponentLink1Description: https://datasheet.ciiva.com/5137/0527451597-ffc-fpc-connectors-170644-5137506.pdf?src-supplier=Mouser; ComponentLink2URL: https://datasheet.ciiva.com/16660/0527451597-ffc-fpc-connectors-16660188.pdf?src-supplier=Avnet+Europe; ComponentLink2Description: https://datasheet.ciiva.com/16660/0527451597-ffc-fpc-connectors-16660188.pdf?src-supplier=Avnet+Europe; ComponentLink3URL: https://datasheet.ciiva.com/10364/0527451597-ffc-fpc-connectors-10364286.pdf?src-supplier=Avnet; ComponentLink3Description: https://datasheet.ciiva.com/10364/0527451597-ffc-fpc-connectors-10364286.pdf?src-supplier=Avnet
L1 = Inductor: Ferrite SMD Construction form: 0805 DC resistance: 0.15 Ohm Impedance @ 100 MHz: 600 Ohm; Manufacturer: Wurth Electronics; Code_IEC: 1005; Current Rating: 2A; Inductance: 5.6H; Tolerance: 25%; Impedance: 600R; Number of Lines: 1; DC Resistance (DCR): 150mR; Published: 8-Jun-2000; LatestRevisionDate: 29-May-2009; LatestRevisionNote: IPC-7351 Footprint Added.; PackageReference: 0402-A; Publisher: Altium Limited; PackageDescription: Chip Inductor; Code_JEITA: 0402; Value: 100MHz @ 600; Supplier 1: Mouser; Supplier Part Number 1: 710-742792040; Manufacturer Part Number: 742792040; RoHS: Yes; Category: Ferrite Beads and Chips; Stock 1: 97012; Pricing 1: 1=0.22000, 10=0.22000, 50=0.21700, 100=0.21700, 500=0.21400, 1000=0.20800, 2000=0.20100, 4000=0.16100, 10000=0.16100 (USD); Mount: Surface Mount; Case/Package: SMD/SMT; Core Material: Ferrite; Weight: 0.000388oz; Case Code (Metric): 2012; Case Code (Imperial): 0805; Material: Ferrite; Min Operating Temperature: -55°C; Max Operating Temperature: 125°C; Package Quantity: 1; Packaging: Tape and Reel; Max Current Rating: 2A; Max DC Current: 2A; Termination: SMD/SMT; Test Frequency: 100MHz; Series: WE-CBF; Length: 2mm; Width: 0.047inch; Height: 0.9mm; Depth: 1.2mm; REACH SVHC: Unknown; Lead Free: Lead Free; RoHS Compliant: Yes; ComponentLink1URL: https://datasheet.ciiva.com/1560/742792040-1560864.pdf?src-supplier=Newark; ComponentLink1Description: https://datasheet.ciiva.com/1560/742792040-1560864.pdf?src-supplier=Newark; ComponentLink2URL: https://datasheet.ciiva.com/1013/742792040-1013539.pdf?src-supplier=Digi-Key; ComponentLink2Description: https://datasheet.ciiva.com/1013/742792040-1013539.pdf?src-supplier=Digi-Key; ComponentLink3URL: https://datasheet.ciiva.com/11799/0900766b80d2dd7f-11799667.pdf?src-supplier=RSComponents; ComponentLink3Description: https://datasheet.ciiva.com/11799/0900766b80d2dd7f-11799667.pdf?src-supplier=RSComponents; ComponentLink4URL: https://datasheet.ciiva.com/22711/1756153-22711349.pdf?src-supplier=Element14; ComponentLink4Description: https://datasheet.ciiva.com/22711/1756153-22711349.pdf?src-supplier=Element14; ComponentLink5URL: https://datasheet.ciiva.com/4940/742792040-80980-4940454.pdf?src-supplier=Mouser; ComponentLink5Description: https://datasheet.ciiva.com/4940/742792040-80980-4940454.pdf?src-supplier=Mouser; ComponentLink6URL: https://datasheet.ciiva.com/1013/742792040-1013540.pdf?src-supplier=Digi-Key; ComponentLink6Description: https://datasheet.ciiva.com/1013/742792040-1013540.pdf?src-supplier=Digi-Key; ComponentLink7URL: https://datasheet.ciiva.com/1013/742792040-1013541.pdf?src-supplier=Digi-Key; ComponentLink7Description: https://datasheet.ciiva.com/1013/742792040-1013541.pdf?src-supplier=Digi-Key; ComponentLink8URL: https://datasheet.ciiva.com/1126/1756153-1126571.pdf?src-supplier=Element14; ComponentLink8Description: https://datasheet.ciiva.com/1126/1756153-1126571.pdf?src-supplier=Element14
LED1 = CMP-1426-00011-1: SMD mono-color Chip LED, WL-SMCW, Red; Manufacturer: Wuerth Elektronik; Color: Red; PartNumber: 150080RS75000; PackageReference: 0805_A; ComponentLink2Description: Datasheet; ComponentLink1URL: http://www.we-online.com; ComponentLink1Description: Manufacturer URL; ComponentLink2URL: http://katalog.we-online.com/led/datasheet/150080RS75000.pdf
R1 = Res2: Res Thick Film 0603 20 Ohm 1% 0.25W(1/4W) ±100ppm/C Sulfur Resistant Pad SMD Automotive T/R; Manufacturer: Panasonic; Published: 8-Jun-2000; LatestRevisionDate: 17-Jul-2002; LatestRevisionNote: Re-released for DXP Platform.; PackageReference: AXIAL-0.4; Publisher: Altium Limited; PackageDescription: Axial Device, Thru-Hole; 2 Leads; 0.4 in Pin Spacing; Supplier 1: Mouser; Supplier Part Number 1: 667-ERJ-UP3F20R0V; Manufacturer Part Number: ERJ-UP3F20R0V; RoHS: No; Category: Chip SMD Resistors; Stock 1: 891; Pricing 1: 1=0.24000, 10=0.21000, 50=0.21000, 100=0.08300, 1000=0.03500, 10000=0.02800 (USD)
R2-R4 R6 R8 R10 R? = Res2: Res Thick Film 0603 10K Ohm 1% 0.25W(1/4W) ±100ppm/C Sulfur Resistant Pad SMD Automotive T/R; Manufacturer: Panasonic; Published: 8-Jun-2000; LatestRevisionDate: 17-Jul-2002; LatestRevisionNote: Re-released for DXP Platform.; PackageReference: AXIAL-0.4; Publisher: Altium Limited; PackageDescription: Axial Device, Thru-Hole; 2 Leads; 0.4 in Pin Spacing; Supplier 1: Mouser; Supplier Part Number 1: 667-ERJ-UP3F1002V; Manufacturer Part Number: ERJ-UP3F1002V; RoHS: No; Category: Chip SMD Resistors; Pricing 1: 1=0.27000, 10=0.21000, 50=0.21000, 100=0.08300, 1000=0.03500, 10000=0.02800 (USD)
R5 = Res2: Res Thick Film 0603 18K Ohm 1% 0.25W(1/4W) ±100ppm/C Sulfur Resistant Pad SMD Automotive T/R; Manufacturer: Panasonic; Published: 8-Jun-2000; LatestRevisionDate: 17-Jul-2002; LatestRevisionNote: Re-released for DXP Platform.; PackageReference: AXIAL-0.4; Publisher: Altium Limited; PackageDescription: Axial Device, Thru-Hole; 2 Leads; 0.4 in Pin Spacing; Supplier 1: Mouser; Supplier Part Number 1: 667-ERJ-UP3F1802V; Manufacturer Part Number: ERJ-UP3F1802V; RoHS: No; Category: Chip SMD Resistors; Stock 1: 471; Pricing 1: 1=0.26000, 10=0.22100, 50=0.22100, 100=0.08600, 1000=0.03600, 10000=0.03000 (USD)
R7 = Res2: Res Thick Film 0603 47 Ohm 5% 0.25W(1/4W) ±200ppm/C Sulfur Resistant Pad SMD Automotive T/R; Manufacturer: Panasonic; Published: 8-Jun-2000; LatestRevisionDate: 17-Jul-2002; LatestRevisionNote: Re-released for DXP Platform.; PackageReference: AXIAL-0.4; Publisher: Altium Limited; PackageDescription: Axial Device, Thru-Hole; 2 Leads; 0.4 in Pin Spacing; Supplier 1: Mouser; Supplier Part Number 1: 667-ERJ-UP3J470V; Manufacturer Part Number: ERJ-UP3J470V; RoHS: No; Stock 1: 8898; Pricing 1: 1=0.18000, 10=0.15000, 50=0.15000, 100=0.05800, 1000=0.03500, 10000=0.01800 (USD)
R9 = Res2: Res Thick Film 0603 1K Ohm 1% 0.25W(1/4W) ±100ppm/C Sulfur Resistant Pad SMD Automotive T/R; Manufacturer: Panasonic; Published: 8-Jun-2000; LatestRevisionDate: 17-Jul-2002; LatestRevisionNote: Re-released for DXP Platform.; PackageReference: AXIAL-0.4; Publisher: Altium Limited; PackageDescription: Axial Device, Thru-Hole; 2 Leads; 0.4 in Pin Spacing; Supplier 1: Mouser; Supplier Part Number 1: 667-ERJ-UP3F1001V; Manufacturer Part Number: ERJ-UP3F1001V; RoHS: No; Category: Chip SMD Resistors; Pricing 1: 1=0.25000, 10=0.21000, 50=0.21000, 100=0.08800, 1000=0.04000, 10000=0.02800 (USD)
R11 = Res2: Res Thick Film 0603 390K Ohm 1% 0.25W(1/4W) ±100ppm/C Sulfur Resistant Pad SMD Automotive T/R; Manufacturer: Panasonic; Published: 8-Jun-2000; LatestRevisionDate: 17-Jul-2002; LatestRevisionNote: Re-released for DXP Platform.; PackageReference: AXIAL-0.4; Publisher: Altium Limited; PackageDescription: Axial Device, Thru-Hole; 2 Leads; 0.4 in Pin Spacing; Supplier 1: Mouser; Supplier Part Number 1: 667-ERJ-UP3F3903V; Manufacturer Part Number: ERJ-UP3F3903V; RoHS: No; Category: Chip SMD Resistors; Stock 1: 3827; Pricing 1: 1=0.26000, 10=0.22100, 50=0.22100, 100=0.08600, 1000=0.03600, 10000=0.03000 (USD)
S1 = 452403012014: Switch Slide DPDT 300MA 6V; Manufacturer: Wurth Electronics; Actuator Material: Polymer,Liquid Crystal Polymer; Contact Style: Non-Shorting; Operating Force: 200gf; Switch Travel: 2mm; Switch Function: On-On; Actuator Type: Standard; Actuator Length: 1.2mm; Supplier 1: Mouser; Supplier Part Number 1: 710-452403012014; Manufacturer Part Number: 452403012014; RoHS: Yes; Stock 1: 5074; Pricing 1: 1=2.51000, 10=2.51000, 50=2.51000, 100=2.10000, 1000=1.69000, 10000=1.50000 (USD); Mount: Surface Mount; Contact Material: Copper Alloy; Contact Plating: Silver; Color: Silver; Min Operating Temperature: -40°C; Max Operating Temperature: 85°C; Packaging: Tape and Reel; Current Rating: 300mA; Voltage Rating (DC): 6V; Termination: SMD/SMT; Throw Configuration: DPDT; RoHS Compliant: Yes; ComponentLink1URL: https://katalog.we-online.de/em/datasheet/452403012014.pdf?src-supplier=Digi-Key; ComponentLink1Description: https://katalog.we-online.de/em/datasheet/452403012014.pdf?src-supplier=Digi-Key
S2 = SKQGAKE010: Switch Tactile N.O. SPST Button Gull Wing 0.05A 12VDC 3.43N SMD T/R; Manufacturer_Name: ALPS; Manufacturer: Alps Electric; Mechanical Life: 100000Cycles; Max Voltage Rating (DC): 12V; Contact Resistance: 100mR; Current Rating: 50mA; Actuator Type: STEM; Actuator Length: 1.5mm; Datasheet Link: https://componentsearchengine.com//SKQGAKE010.pdf; Mouser2 Part Number: 688-SKQGAKE010; Mouser2 Price/Stock: https://www.mouser.com/Search/Refine.aspx?Keyword=688-SKQGAKE010; Manufacturer_Part_Number: SKQGAKE010; Supplier 1: Mouser; Supplier Part Number 1: 688-SKQGAKE010; Manufacturer Part Number: SKQGAKE010; RoHS: Yes; Category: Tactile Switches; Pricing 1: 1=0.63000, 10=0.60000, 25=0.57800, 50=0.57800, 100=0.50000, 250=0.45600, 500=0.42300, 1000=0.37800, 2000=0.35800, 4000=0.33600, 10000=0.33600 (USD); Mount: Surface Mount; Case/Package: SMD/SMT; Contact Plating: Silver; Min Operating Temperature: -30°C; Max Operating Temperature: 85°C; Operating Force: 3.43N; Termination: Gull Wing; Voltage Rating (DC): 12V; Throw Configuration: SPST; Packaging: Tape and Reel; Max Current Rating: 50mA; Contact Current Rating: 50mA; Electrical Life: 100000Cycles; Insulation Resistance: 100MR; Orientation: Straight; Series: SKQG; Length: 6.4mm; Width: 5.2mm; Depth: 5.2mm; Radiation Hardening: No; REACH SVHC: No SVHC; Lead Free: Lead Free; RoHS Compliant: Yes; ComponentLink1URL: https://datasheet.ciiva.com/7573/78970-7573282.pdf?src-supplier=Newark; ComponentLink1Description: https://datasheet.ciiva.com/7573/78970-7573282.pdf?src-supplier=Newark; ComponentLink2URL: https://datasheet.ciiva.com/16156/skqg-16156118.pdf?src-supplier=Onlinecomponents.com; ComponentLink2Description: https://datasheet.ciiva.com/16156/skqg-16156118.pdf?src-supplier=Onlinecomponents.com; ComponentLink3URL: https://datasheet.ciiva.com/5283/skqg-180836-5283912.pdf?src-supplier=Mouser; ComponentLink3Description: https://datasheet.ciiva.com/5283/skqg-180836-5283912.pdf?src-supplier=Mouser; ComponentLink4URL: https://datasheet.ciiva.com/18233/getdatasheetpartid-652065-18233082.pdf?src-supplier=Verical; ComponentLink4Description: https://datasheet.ciiva.com/18233/getdatasheetpartid-652065-18233082.pdf?src-supplier=Verical
Y1 = NX3225SA-16.000000MHZ-T1: Crystal 16.0000MHZ 10PF SMD; Manufacturer: NDK; Frequency: 16MHz; Frequency Stability: 10ppm; ESR (Equivalent Series Resistance): 80R; Supplier 1: Mouser; Supplier Part Number 1: 344-NX3225SA16MHZT1; Manufacturer Part Number: NX3225SA-16.000000MHZ-T1; RoHS: Yes; Category: Crystals; Pricing 1: 1=0.92000, 10=0.76000, 50=0.76000, 100=0.67100, 500=0.63600, 1000=0.53000, 10000=0.53000 (USD); Mount: Surface Mount; Case/Package: SMD/SMT; Min Operating Temperature: -20°C; Max Operating Temperature: 70°C; Frequency Tolerance: 10ppm; Load Capacitance: 10pF; Packaging: Tape and Reel; Package Quantity: 3000; Length: 0.126inch; Width: 0.098inch; Height: 0.028inch; Lead Free: Lead Free; ComponentLink1URL: https://datasheet.ciiva.com/860/nx3225sa-16-000000mhz-t1-860715.pdf?src-supplier=Digi-Key; ComponentLink1Description: https://datasheet.ciiva.com/860/nx3225sa-16-000000mhz-t1-860715.pdf?src-supplier=Digi-Key; ComponentLink2URL: https://datasheet.ciiva.com/860/nx3225sa-16-000000mhz-t1-860716.pdf?src-supplier=Digi-Key; ComponentLink2Description: https://datasheet.ciiva.com/860/nx3225sa-16-000000mhz-t1-860716.pdf?src-supplier=Digi-Key; ComponentLink3URL: https://datasheet.ciiva.com/860/nx3225sa-16-000000mhz-t1-860717.pdf?src-supplier=Digi-Key; ComponentLink3Description: https://datasheet.ciiva.com/860/nx3225sa-16-000000mhz-t1-860717.pdf?src-supplier=Digi-Key